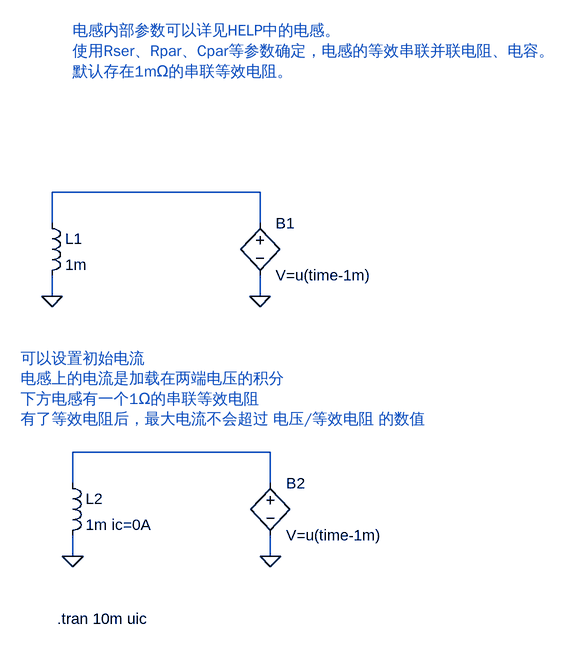
[diagram p0: schematic 12.电感.asc]
12.电感.asc, the LTspice schematic file:
Version 4
SHEET 1 924 1008
WIRE 208 336 -112 336
WIRE -112 384 -112 336
WIRE 208 384 208 336
WIRE -112 496 -112 464
WIRE 208 496 208 464
WIRE 224 736 -80 736
WIRE -80 784 -80 736
WIRE 224 784 224 736
WIRE -80 896 -80 864
WIRE 224 896 224 864
FLAG -112 496 0
FLAG 208 496 0
FLAG -80 896 0
FLAG 224 896 0
SYMBOL ind -128 368 R0
SYMATTR InstName L1
SYMATTR Value 1m
SYMBOL ind -96 768 R0
SYMATTR InstName L2
SYMATTR Value 1m ic=0A
SYMATTR SpiceLine Rser=1
SYMBOL bv 208 368 R0
SYMATTR InstName B1
SYMATTR Value V=u(time-1m)
SYMBOL bv 224 768 R0
SYMATTR InstName B2
SYMATTR Value V=u(time-1m)
TEXT -80 88 Left 2 ;电感内部参数可以详见HELP中的电感。\n使用Rser、Rpar、Cpar等参数确定，电感的等效串联并联电阻、电容。\n默认存在1mΩ的串联等效电阻。
TEXT -104 992 Left 2 !.tran 10m uic
TEXT -160 592 Left 2 ;可以设置初始电流\n电感上的电流是加载在两端电压的积分\n下方电感有一个1Ω的串联等效电阻\n有了等效电阻后，最大电流不会超过 电压/等效电阻 的数值

The netlist it stands for:
* 12.电感.asc
L1 N001 0 1m
L2 N002 0 1m ic=0A Rser=1
B1 N001 0 V=u(time-1m)
B2 N002 0 V=u(time-1m)
* 电感内部参数可以详见HELP中的电感。
* 使用Rser、Rpar、Cpar等参数确定，电感的等效串联并联电阻、电容。
* 默认存在1mΩ的串联等效电阻。
.tran 10m uic
* 可以设置初始电流
* 电感上的电流是加载在两端电压的积分
* 下方电感有一个1Ω的串联等效电阻
* 有了等效电阻后，最大电流不会超过 电压/等效电阻 的数值
.backanno
.end